# EAGLE schematic tick-controller-mk-2 (EAGLE 6.5.0)
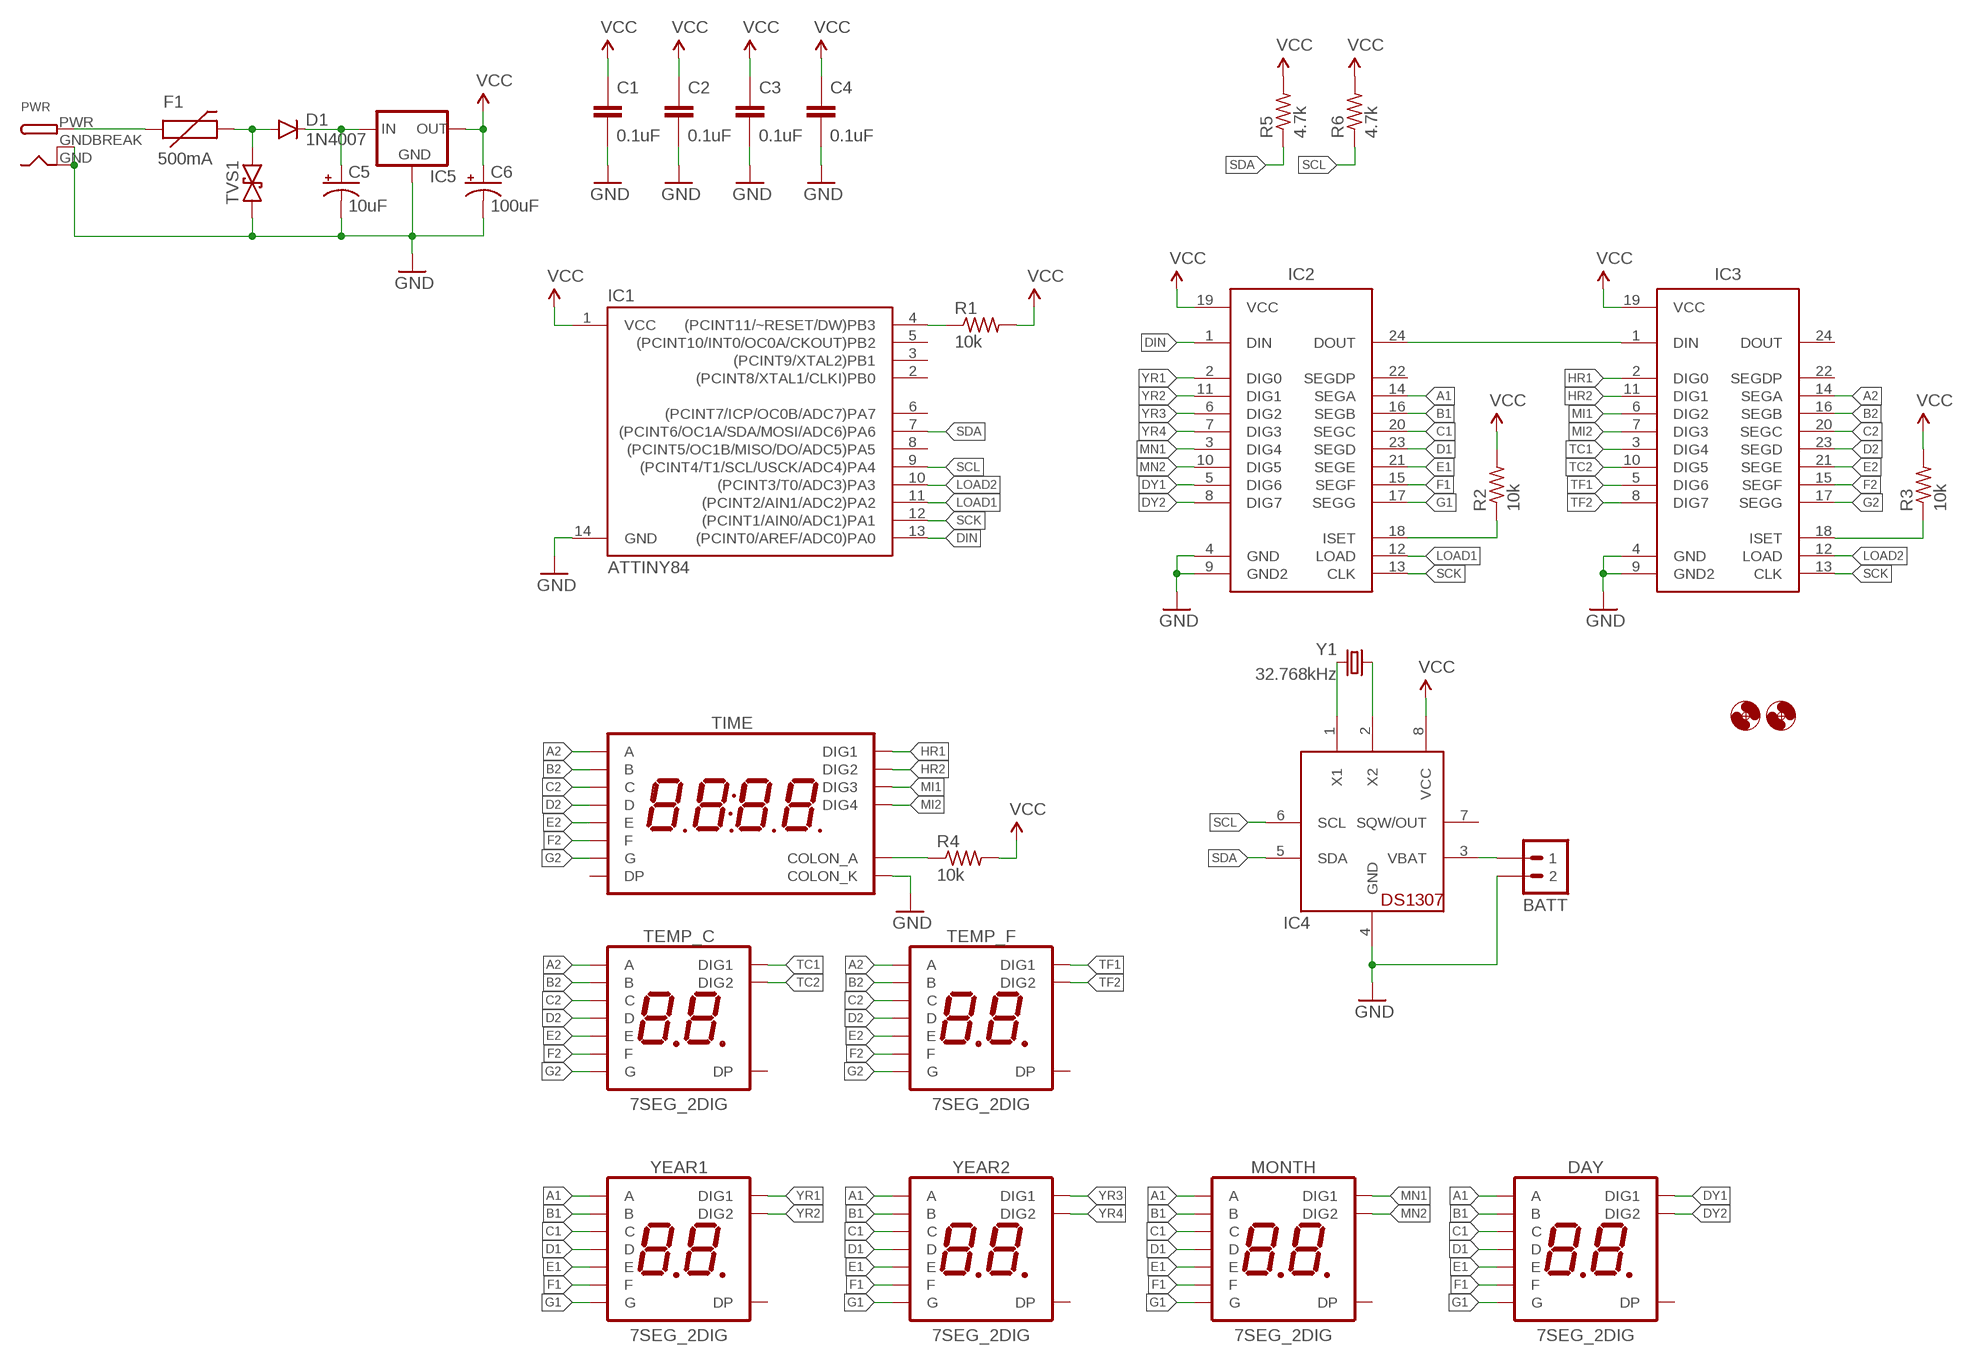
[diagram p0: schematic, sheet 1]

## Parts
BATT  M02JST-PTH-VERT  [JST-2-PH-VERT-PTH]
C1  0.1uF  CAPACITOR-CERAMIC025-024X044  [C025-024X044]
C2  0.1uF  CAPACITOR-CERAMIC025-024X044  [C025-024X044]
C3  0.1uF  CAPACITOR-CERAMIC025-024X044  [C025-024X044]
C4  0.1uF  CAPACITOR-CERAMIC025-024X044  [C025-024X044]
C5  10uF  CAPACITOR-POLARIZEDE2-5  [E2-5]
C6  100uF  CAPACITOR-POLARIZEDE2-5  [E2-5]
D1  1N4007  DIODEPTH-10.68MM  [DIODE-10.16MM]
DAY  7SEG_2DIG  [7SEG_2DIG_14MM]
F1  500mA  PTCPTH  [PTC]
H1  HOLE#2  [HOLE-#2]
H2  HOLE#2  [HOLE-#2]
IC1  ATTINY84  ATTINY84ATTINY84-20PU  [DIL14]
IC2  MAX7219  MAX7219DIP  [DIL24]
IC3  MAX7219  MAX7219DIP  [DIL24]
IC4  DS1307  [DIL08]
IC5  L7805  V_REG_78XXSIDE  [78XXL]
MONTH  7SEG_2DIG  [7SEG_2DIG_14MM]
PWR  DCBARRELPTH  [DCJACK_2MM_PTH]
R1  10k  RESISTORPTH-AXIAL-5.08MM  [RESISTOR-AXIAL-PTH-5.08MM]
R2  10k  RESISTORPTH-AXIAL-5.08MM  [RESISTOR-AXIAL-PTH-5.08MM]
R3  10k  RESISTORPTH-AXIAL-5.08MM  [RESISTOR-AXIAL-PTH-5.08MM]
R4  10k  RESISTORPTH-AXIAL-5.08MM  [RESISTOR-AXIAL-PTH-5.08MM]
R5  4.7k  RESISTORPTH-AXIAL-5.08MM  [RESISTOR-AXIAL-PTH-5.08MM]
R6  4.7k  RESISTORPTH-AXIAL-5.08MM  [RESISTOR-AXIAL-PTH-5.08MM]
TEMP_C  7SEG_2DIG  [7SEG_2DIG_14MM]
TEMP_F  7SEG_2DIG  [7SEG_2DIG_14MM]
TIME  7SED_4DIGIT_14MM14.2MM-CC  [7SEG_4DIG]
TVS1  TVSDO-41-TVS-BIDIRECTIONAL  [DO-41-TVS]
Y1  32.768kHz  CRYSTALTC26H  [TC26H]
YEAR1  7SEG_2DIG  [7SEG_2DIG_14MM]
YEAR2  7SEG_2DIG  [7SEG_2DIG_14MM]

## Nets
A1: DAY.4(A) IC2.14(SEGA) MONTH.4(A) YEAR1.4(A) YEAR2.4(A)
A2: IC3.14(SEGA) TEMP_C.4(A) TEMP_F.4(A) TIME.P$13(A)
B1: DAY.3(B) IC2.16(SEGB) MONTH.3(B) YEAR1.3(B) YEAR2.3(B)
B2: IC3.16(SEGB) TEMP_C.3(B) TEMP_F.3(B) TIME.P$9(B)
C1: DAY.9(C) IC2.20(SEGC) MONTH.9(C) YEAR1.9(C) YEAR2.9(C)
C2: IC3.20(SEGC) TEMP_C.9(C) TEMP_F.9(C) TIME.P$4(C)
D1: DAY.8(D) IC2.23(SEGD) MONTH.8(D) YEAR1.8(D) YEAR2.8(D)
D2: IC3.23(SEGD) TEMP_C.8(D) TEMP_F.8(D) TIME.P$2(D)
DIN: IC1.13((PCINT0/AREF/ADC0)PA0) IC2.1(DIN)
DY1: DAY.5(DIG1) IC2.5(DIG6)
DY2: DAY.10(DIG2) IC2.8(DIG7)
E1: DAY.6(E) IC2.21(SEGE) MONTH.6(E) YEAR1.6(E) YEAR2.6(E)
E2: IC3.21(SEGE) TEMP_C.6(E) TEMP_F.6(E) TIME.P$1(E)
F1: DAY.7(F) IC2.15(SEGF) MONTH.7(F) YEAR1.7(F) YEAR2.7(F)
F2: IC3.15(SEGF) TEMP_C.7(F) TEMP_F.7(F) TIME.P$12(F)
G1: DAY.1(G) IC2.17(SEGG) MONTH.1(G) YEAR1.1(G) YEAR2.1(G)
G2: IC3.17(SEGG) TEMP_C.1(G) TEMP_F.1(G) TIME.P$5(G)
GND: BATT.2 C1.2 C2.2 C3.2 C4.2 C5.- C6.- IC1.14(GND) IC2.4(GND) IC2.9(GND2) IC3.4(GND) IC3.9(GND2) IC4.4(GND) IC5.GND PWR.GND PWR.GNDBREAK TIME.P$7(COLON_K) TVS1.P$1
HR1: IC3.2(DIG0) TIME.P$14(DIG1)
HR2: IC3.11(DIG1) TIME.P$11(DIG2)
LOAD1: IC1.11((PCINT2/AIN1/ADC2)PA2) IC2.12(LOAD)
LOAD2: IC1.10((PCINT3/T0/ADC3)PA3) IC3.12(LOAD)
MI1: IC3.6(DIG2) TIME.P$10(DIG3)
MI2: IC3.7(DIG3) TIME.P$6(DIG4)
MN1: IC2.3(DIG4) MONTH.5(DIG1)
MN2: IC2.10(DIG5) MONTH.10(DIG2)
N$1: IC1.4((PCINT11/~RESET/DW)PB3) R1.P$1
N$2: IC2.18(ISET) R2.P$1
N$3: IC4.1(X1) Y1.2
N$4: BATT.1 IC4.3(VBAT)
N$5: IC4.2(X2) Y1.1
N$6: C5.+ D1.C IC5.IN
N$7: F1.P$1 PWR.PWR
N$8: D1.A F1.P$2 TVS1.P$2
N$13: IC2.24(DOUT) IC3.1(DIN)
N$17: IC3.18(ISET) R3.P$1
N$18: R4.P$1 TIME.P$8(COLON_A)
SCK: IC1.12((PCINT1/AIN0/ADC1)PA1) IC2.13(CLK) IC3.13(CLK)
SCL: IC1.9((PCINT4/T1/SCL/USCK/ADC4)PA4) IC4.6(SCL) R6.P$1
SDA: IC1.7((PCINT6/OC1A/SDA/MOSI/ADC6)PA6) IC4.5(SDA) R5.P$1
TC1: IC3.3(DIG4) TEMP_C.5(DIG1)
TC2: IC3.10(DIG5) TEMP_C.10(DIG2)
TF1: IC3.5(DIG6) TEMP_F.5(DIG1)
TF2: IC3.8(DIG7) TEMP_F.10(DIG2)
VCC: C1.1 C2.1 C3.1 C4.1 C6.+ IC1.1(VCC) IC2.19(VCC) IC3.19(VCC) IC4.8(VCC) IC5.OUT R1.P$2 R2.P$2 R3.P$2 R4.P$2 R5.P$2 R6.P$2
YR1: IC2.2(DIG0) YEAR1.5(DIG1)
YR2: IC2.11(DIG1) YEAR1.10(DIG2)
YR3: IC2.6(DIG2) YEAR2.5(DIG1)
YR4: IC2.7(DIG3) YEAR2.10(DIG2)
Unconnected: DAY.2(DP) IC1.2((PCINT8/XTAL1/CLKI)PB0) IC1.3((PCINT9/XTAL2)PB1) IC1.5((PCINT10/INT0/OC0A/CKOUT)PB2) IC1.6((PCINT7/ICP/OC0B/ADC7)PA7) IC1.8((PCINT5/OC1B/MISO/DO/ADC5)PA5) IC2.22(SEGDP) IC3.22(SEGDP) IC3.24(DOUT) IC4.7(SQW/OUT) MONTH.2(DP) TEMP_C.2(DP) TEMP_F.2(DP) TIME.P$3(DP) YEAR1.2(DP) YEAR2.2(DP)

## Library data of the parts
BATT = A_butts:M02: Standard 2-pin 0.1" header. Use with - straight break away headers ( PRT-00116) - right angle break away headers (PRT-00553) - swiss pins (PRT-00743) - machine pins (PRT-00117) - female headers (PRT-00115) Molex polarized connector foot print use with: PRT-08233 with associated crimp pins and housings. 2.54_SCREWTERM for use with PRT-10571. 3.5mm Screw Terminal footprints for PRT-08084 5mm Screw Terminal footprints for use with PRT-08433
C1-C4 = A_butts:CAPACITOR-CERAMIC: CAPACITOR, European symbol
C5 C6 = A_butts:CAPACITOR-POLARIZED: POLARIZED CAPACITOR, American symbol
D1 = A_butts:DIODE: Diode These are standard reverse protection diodes and small signal diodes. SMA package can handle up to about 1A. SOD-323 can handle about 200mA. What the SOD-323 package when ordering, there are some mfgs out there that are 5-pin packages.
DAY MONTH TEMP_C TEMP_F YEAR1 YEAR2 = A_butts:7SEG_2DIG
F1 = A_butts:PTC: Resettable Fuse PTC Resettable Fuse. Spark Fun Electronics SKU : COM-08357
H1 H2 = A_butts:HOLE: MOUNTING HOLE with drill center marker
IC1 = A_butts:ATTINY84: Atmel 14-pin 2/4/8kB flash uC
IC2 IC3 = A_butts:MAX7219: 8-digit, 8-segment LED display driver, serial input
IC4 = A_butts:DS1307: DS1307 Real time clock (RTC) with battery backup ability. Talk to it via i2c
IC5 = A_butts:V_REG_78XX: Voltage Regulator Standard 7805 5V regulator. IGO (Input Ground Output). Spark Fun Electronics SKU : COM-00107
PWR = A_butts:DCBARREL: 2.0mm DC Barrel Jack DCJACK_2MM_PTH - Through Hole Jack (4UConnector: 05537)
R1-R6 = A_butts:RESISTOR: RESISTOR, American symbol
TIME = A_butts:7SED_4DIGIT_14MM
TVS1 = A_butts:TVS: Transient voltage suppressor- prevents ESD on inputs. Ignore package description- MBRA140 is NOT this type of part!!!
Y1 = A_butts:CRYSTAL: Various standard crystals. Proven footprints. Spark Fun Electronics SKU : COM-00534